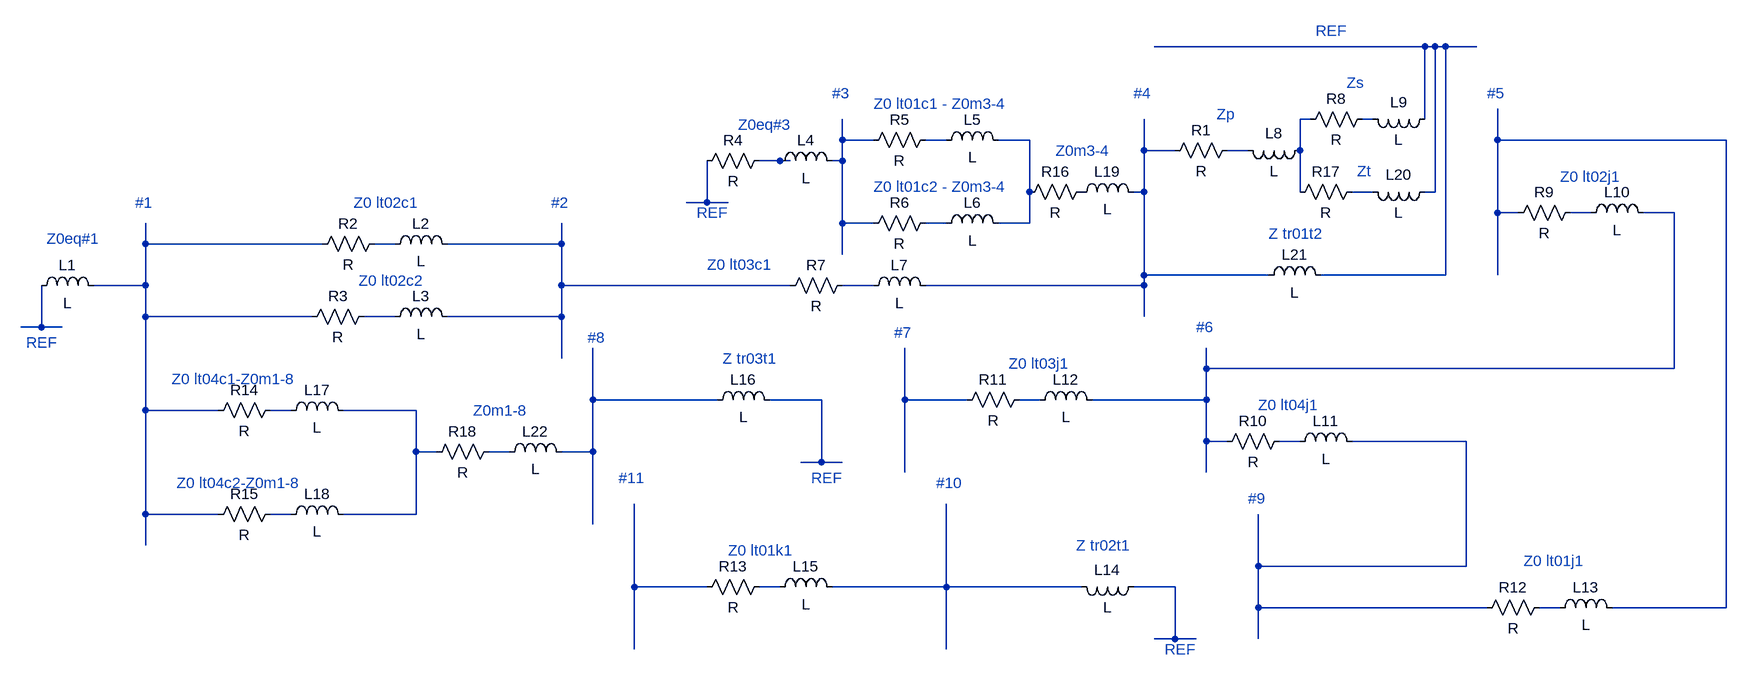
[diagram p0: schematic Diagrama seq zero.asc]
Diagrama seq zero.asc, the LTspice schematic file:
Version 4
SHEET 1 2728 696
WIRE 2080 -336 1664 -336
WIRE 2096 -336 2080 -336
WIRE 2112 -336 2096 -336
WIRE 2160 -336 2112 -336
WIRE 1904 -224 1888 -224
WIRE 2000 -224 1984 -224
WIRE 2080 -224 2080 -336
WIRE 1184 -192 1184 -224
WIRE 1232 -192 1184 -192
WIRE 1344 -192 1312 -192
WIRE 1472 -192 1424 -192
WIRE 2192 -192 2192 -240
WIRE 2544 -192 2192 -192
WIRE 1648 -176 1648 -224
WIRE 1696 -176 1648 -176
WIRE 1808 -176 1776 -176
WIRE 1888 -176 1888 -224
WIRE 1088 -160 1056 -160
WIRE 1104 -160 1088 -160
WIRE 1184 -160 1184 -192
WIRE 1184 -160 1168 -160
WIRE 1472 -112 1472 -192
WIRE 1648 -112 1648 -176
WIRE 1648 -112 1632 -112
WIRE 1888 -112 1888 -176
WIRE 2000 -112 1968 -112
WIRE 2096 -112 2096 -336
WIRE 2096 -112 2080 -112
WIRE 976 -96 976 -160
WIRE 976 -96 944 -96
WIRE 1008 -96 976 -96
WIRE 2192 -80 2192 -192
WIRE 2224 -80 2192 -80
WIRE 2336 -80 2304 -80
WIRE 2464 -80 2416 -80
WIRE 1184 -64 1184 -160
WIRE 1232 -64 1184 -64
WIRE 1344 -64 1312 -64
WIRE 1472 -64 1472 -112
WIRE 1472 -64 1424 -64
WIRE 112 -32 112 -64
WIRE 384 -32 112 -32
WIRE 496 -32 464 -32
WIRE 752 -32 752 -64
WIRE 752 -32 576 -32
WIRE 1184 -16 1184 -64
WIRE 1648 16 1648 -112
WIRE 1840 16 1648 16
WIRE 2112 16 2112 -336
WIRE 2112 16 1920 16
WIRE 2192 16 2192 -80
WIRE 112 32 112 -32
WIRE 112 32 32 32
WIRE 752 32 752 -32
WIRE 1104 32 752 32
WIRE 1232 32 1184 32
WIRE 1648 32 1648 16
WIRE 1648 32 1312 32
WIRE 112 80 112 32
WIRE 368 80 112 80
WIRE 496 80 448 80
WIRE 752 80 752 32
WIRE 752 80 576 80
WIRE 1648 80 1648 32
WIRE -48 96 -48 32
WIRE -48 96 -80 96
WIRE -16 96 -48 96
WIRE 752 144 752 80
WIRE 1744 160 1744 128
WIRE 2464 160 2464 -80
WIRE 2464 160 1744 160
WIRE 800 208 800 128
WIRE 992 208 800 208
WIRE 1152 208 1072 208
WIRE 1280 208 1280 128
WIRE 1376 208 1280 208
WIRE 1488 208 1456 208
WIRE 1744 208 1744 160
WIRE 1744 208 1568 208
WIRE 112 224 112 80
WIRE 224 224 112 224
WIRE 336 224 304 224
WIRE 528 224 416 224
WIRE 1744 272 1744 208
WIRE 1776 272 1744 272
WIRE 1888 272 1856 272
WIRE 2144 272 1968 272
WIRE 528 288 528 224
WIRE 560 288 528 288
WIRE 672 288 640 288
WIRE 800 288 800 208
WIRE 800 288 752 288
WIRE 1152 304 1152 208
WIRE 1152 304 1120 304
WIRE 1184 304 1152 304
WIRE 1280 320 1280 208
WIRE 1744 320 1744 272
WIRE 112 384 112 224
WIRE 224 384 112 384
WIRE 336 384 304 384
WIRE 528 384 528 288
WIRE 528 384 416 384
WIRE 800 400 800 288
WIRE 112 432 112 384
WIRE 1824 464 1824 384
WIRE 2144 464 2144 272
WIRE 2144 464 1824 464
WIRE 864 496 864 368
WIRE 976 496 864 496
WIRE 1088 496 1056 496
WIRE 1344 496 1344 368
WIRE 1344 496 1168 496
WIRE 1552 496 1344 496
WIRE 1696 496 1632 496
WIRE 1824 528 1824 464
WIRE 2176 528 1824 528
WIRE 2288 528 2256 528
WIRE 2544 528 2544 -192
WIRE 2544 528 2368 528
WIRE 1696 576 1696 496
WIRE 1696 576 1664 576
WIRE 1728 576 1696 576
WIRE 1824 576 1824 528
WIRE 864 592 864 496
WIRE 1344 592 1344 496
SYMBOL ind -64 48 R270
WINDOW 0 32 56 VTop 2
WINDOW 3 5 56 VBottom 2
SYMATTR InstName L1
SYMBOL res 480 -48 R90
WINDOW 0 0 56 VBottom 2
WINDOW 3 32 56 VTop 2
SYMATTR InstName R2
SYMBOL ind 480 -16 R270
WINDOW 0 32 56 VTop 2
WINDOW 3 5 56 VBottom 2
SYMATTR InstName L2
SYMBOL ind 480 96 R270
WINDOW 0 32 56 VTop 2
WINDOW 3 5 56 VBottom 2
SYMATTR InstName L3
SYMBOL res 464 64 R90
WINDOW 0 0 56 VBottom 2
WINDOW 3 32 56 VTop 2
SYMATTR InstName R3
SYMBOL res 1072 -176 R90
WINDOW 0 0 56 VBottom 2
WINDOW 3 32 56 VTop 2
SYMATTR InstName R4
SYMBOL ind 1072 -144 R270
WINDOW 0 32 56 VTop 2
WINDOW 3 5 56 VBottom 2
SYMATTR InstName L4
SYMBOL res 1328 -208 R90
WINDOW 0 0 56 VBottom 2
WINDOW 3 32 56 VTop 2
SYMATTR InstName R5
SYMBOL ind 1328 -176 R270
WINDOW 0 32 56 VTop 2
WINDOW 3 5 56 VBottom 2
SYMATTR InstName L5
SYMBOL res 1328 -80 R90
WINDOW 0 0 56 VBottom 2
WINDOW 3 32 56 VTop 2
SYMATTR InstName R6
SYMBOL ind 1328 -48 R270
WINDOW 0 32 56 VTop 2
WINDOW 3 5 56 VBottom 2
SYMATTR InstName L6
SYMBOL res 1200 16 R90
WINDOW 0 0 56 VBottom 2
WINDOW 3 32 56 VTop 2
SYMATTR InstName R7
SYMBOL ind 1216 48 R270
WINDOW 0 32 56 VTop 2
WINDOW 3 5 56 VBottom 2
SYMATTR InstName L7
SYMBOL res 2320 -96 R90
WINDOW 0 0 56 VBottom 2
WINDOW 3 32 56 VTop 2
SYMATTR InstName R9
SYMBOL ind 2320 -64 R270
WINDOW 0 32 56 VTop 2
WINDOW 3 5 56 VBottom 2
SYMATTR InstName L10
SYMBOL res 1872 256 R90
WINDOW 0 0 56 VBottom 2
WINDOW 3 32 56 VTop 2
SYMATTR InstName R10
SYMBOL ind 1872 288 R270
WINDOW 0 32 56 VTop 2
WINDOW 3 5 56 VBottom 2
SYMATTR InstName L11
SYMBOL res 1472 192 R90
WINDOW 0 0 56 VBottom 2
WINDOW 3 32 56 VTop 2
SYMATTR InstName R11
SYMBOL ind 1472 224 R270
WINDOW 0 32 56 VTop 2
WINDOW 3 5 56 VBottom 2
SYMATTR InstName L12
SYMBOL res 2272 512 R90
WINDOW 0 0 56 VBottom 2
WINDOW 3 32 56 VTop 2
SYMATTR InstName R12
SYMBOL ind 2272 544 R270
WINDOW 0 32 56 VTop 2
WINDOW 3 5 56 VBottom 2
SYMATTR InstName L13
SYMBOL ind 1648 480 R90
WINDOW 0 5 56 VBottom 2
WINDOW 3 32 56 VTop 2
SYMATTR InstName L14
SYMBOL res 1072 480 R90
WINDOW 0 0 56 VBottom 2
WINDOW 3 32 56 VTop 2
SYMATTR InstName R13
SYMBOL ind 1072 512 R270
WINDOW 0 32 56 VTop 2
WINDOW 3 5 56 VBottom 2
SYMATTR InstName L15
SYMBOL ind 976 224 R270
WINDOW 0 32 56 VTop 2
WINDOW 3 5 56 VBottom 2
SYMATTR InstName L16
SYMBOL res 320 208 R90
WINDOW 0 0 56 VBottom 2
WINDOW 3 32 56 VTop 2
SYMATTR InstName R14
SYMBOL ind 320 240 R270
WINDOW 0 32 56 VTop 2
WINDOW 3 5 56 VBottom 2
SYMATTR InstName L17
SYMBOL res 320 368 R90
WINDOW 0 0 56 VBottom 2
WINDOW 3 32 56 VTop 2
SYMATTR InstName R15
SYMBOL ind 320 400 R270
WINDOW 0 32 56 VTop 2
WINDOW 3 5 56 VBottom 2
SYMATTR InstName L18
SYMBOL res 1568 -128 R90
WINDOW 0 0 56 VBottom 2
WINDOW 3 32 56 VTop 2
SYMATTR InstName R16
SYMBOL ind 1536 -96 R270
WINDOW 0 32 56 VTop 2
WINDOW 3 5 56 VBottom 2
SYMATTR InstName L19
SYMBOL res 1792 -192 R90
WINDOW 0 0 56 VBottom 2
WINDOW 3 32 56 VTop 2
SYMATTR InstName R1
SYMBOL ind 1904 -192 R90
WINDOW 0 5 56 VBottom 2
WINDOW 3 32 56 VTop 2
SYMATTR InstName L8
SYMBOL res 2000 -240 R90
WINDOW 0 0 56 VBottom 2
WINDOW 3 32 56 VTop 2
SYMATTR InstName R8
SYMBOL ind 2096 -240 R90
WINDOW 0 5 56 VBottom 2
WINDOW 3 32 56 VTop 2
SYMATTR InstName L9
SYMBOL res 1984 -128 R90
WINDOW 0 0 56 VBottom 2
WINDOW 3 32 56 VTop 2
SYMATTR InstName R17
SYMBOL ind 2096 -128 R90
WINDOW 0 5 56 VBottom 2
WINDOW 3 32 56 VTop 2
SYMATTR InstName L20
SYMBOL ind 1824 32 R270
WINDOW 0 32 56 VTop 2
WINDOW 3 5 56 VBottom 2
SYMATTR InstName L21
SYMBOL res 656 272 R90
WINDOW 0 0 56 VBottom 2
WINDOW 3 32 56 VTop 2
SYMATTR InstName R18
SYMBOL ind 656 304 R270
WINDOW 0 32 56 VTop 2
WINDOW 3 5 56 VBottom 2
SYMATTR InstName L22
TEXT -72 120 Left 2 ;REF
TEXT 432 -96 Left 2 ;Z0 lt02c1
TEXT 440 24 Left 2 ;Z0 lt02c2
TEXT -40 -40 Left 2 ;Z0eq#1
TEXT 96 -96 Left 2 ;#1
TEXT 736 -96 Left 2 ;#2
TEXT 960 -80 Left 2 ;REF
TEXT 1024 -216 Left 2 ;Z0eq#3
TEXT 1232 -248 Left 2 ;Z0 lt01c1 - Z0m3-4
TEXT 1232 -120 Left 2 ;Z0 lt01c2 - Z0m3-4
TEXT 1168 -264 Left 2 ;#3
TEXT 1632 -264 Left 2 ;#4
TEXT 976 0 Left 2 ;Z0 lt03c1
TEXT 2176 -264 Left 2 ;#5
TEXT 1760 -232 Left 2 ;Zp
TEXT 1728 96 Left 2 ;#6
TEXT 1808 360 Left 2 ;#9
TEXT 2288 -136 Left 2 ;Z0 lt02j1
TEXT 1824 216 Left 2 ;Z0 lt04j1
TEXT 1264 104 Left 2 ;#7
TEXT 1440 152 Left 2 ;Z0 lt03j1
TEXT 2232 456 Left 2 ;Z0 lt01j1
TEXT 1328 336 Left 2 ;#10
TEXT 1544 432 Left 2 ;Z tr02t1
TEXT 1008 440 Left 2 ;Z0 lt01k1
TEXT 840 328 Left 2 ;#11
TEXT 792 112 Left 2 ;#8
TEXT 1000 144 Left 2 ;Z tr03t1
TEXT 152 176 Left 2 ;Z0 lt04c1-Z0m1-8
TEXT 160 336 Left 2 ;Z0 lt04c2-Z0m1-8
TEXT 1512 -176 Left 2 ;Z0m3-4
TEXT 1680 592 Left 2 ;REF
TEXT 1912 -360 Left 2 ;REF
TEXT 1960 -280 Left 2 ;Zs
TEXT 1976 -144 Left 2 ;Zt
TEXT 1136 328 Left 2 ;REF
TEXT 1840 -48 Left 2 ;Z tr01t2
TEXT 616 224 Left 2 ;Z0m1-8

The netlist it stands for:
* Diagrama seq zero.asc
L1 N021 N016 L
R2 N017 N016 R
L2 N017 N018 L
L3 N020 N018 L
R3 N020 N016 R
R4 N010 N012 R
L4 N010 N004 L
R5 N005 N004 R
L5 N005 N006 L
R6 N015 N004 R
L6 N015 N006 L
R7 N019 N018 R
L7 N019 N008 L
R9 N013 N007 R
L10 N013 N014 L
R10 N028 N014 R
L11 N028 N029 L
R11 N025 N024 R
L12 N025 N014 L
R12 N036 N029 R
L13 N036 N007 L
L14 N035 N034 L
R13 N033 N032 R
L15 N033 N034 L
L16 N022 N023 L
R14 N026 N016 R
L17 N026 N027 L
R15 N031 N016 R
L18 N031 N027 L
R16 P001 N006 R
L19 P001 N008 L
R1 N009 N008 R
L8 N002 N009 L
R8 N003 N002 R
L9 N001 N003 L
R17 N011 N002 R
L20 N001 N011 L
L21 N008 N001 L
R18 N030 N027 R
L22 N030 N022 L
* REF
* Z0 lt02c1
* Z0 lt02c2
* Z0eq#1
* #1
* #2
* REF
* Z0eq#3
* Z0 lt01c1 - Z0m3-4
* Z0 lt01c2 - Z0m3-4
* #3
* #4
* Z0 lt03c1
* #5
* Zp
* #6
* #9
* Z0 lt02j1
* Z0 lt04j1
* #7
* Z0 lt03j1
* Z0 lt01j1
* #10
* Z tr02t1
* Z0 lt01k1
* #11
* #8
* Z tr03t1
* Z0 lt04c1-Z0m1-8
* Z0 lt04c2-Z0m1-8
* Z0m3-4
* REF
* REF
* Zs
* Zt
* REF
* Z tr01t2
* Z0m1-8
.backanno
.end